# EasyEDA schematic SCH_Signal Jammer_2023-12-11.json
TITLE: Signal Jammer by A1 Electronics; REV: 1.0; Date: 2023-12-10; Sheet: 1/1; Drawn By: A Rama; Company: ahyanrblogspot.com
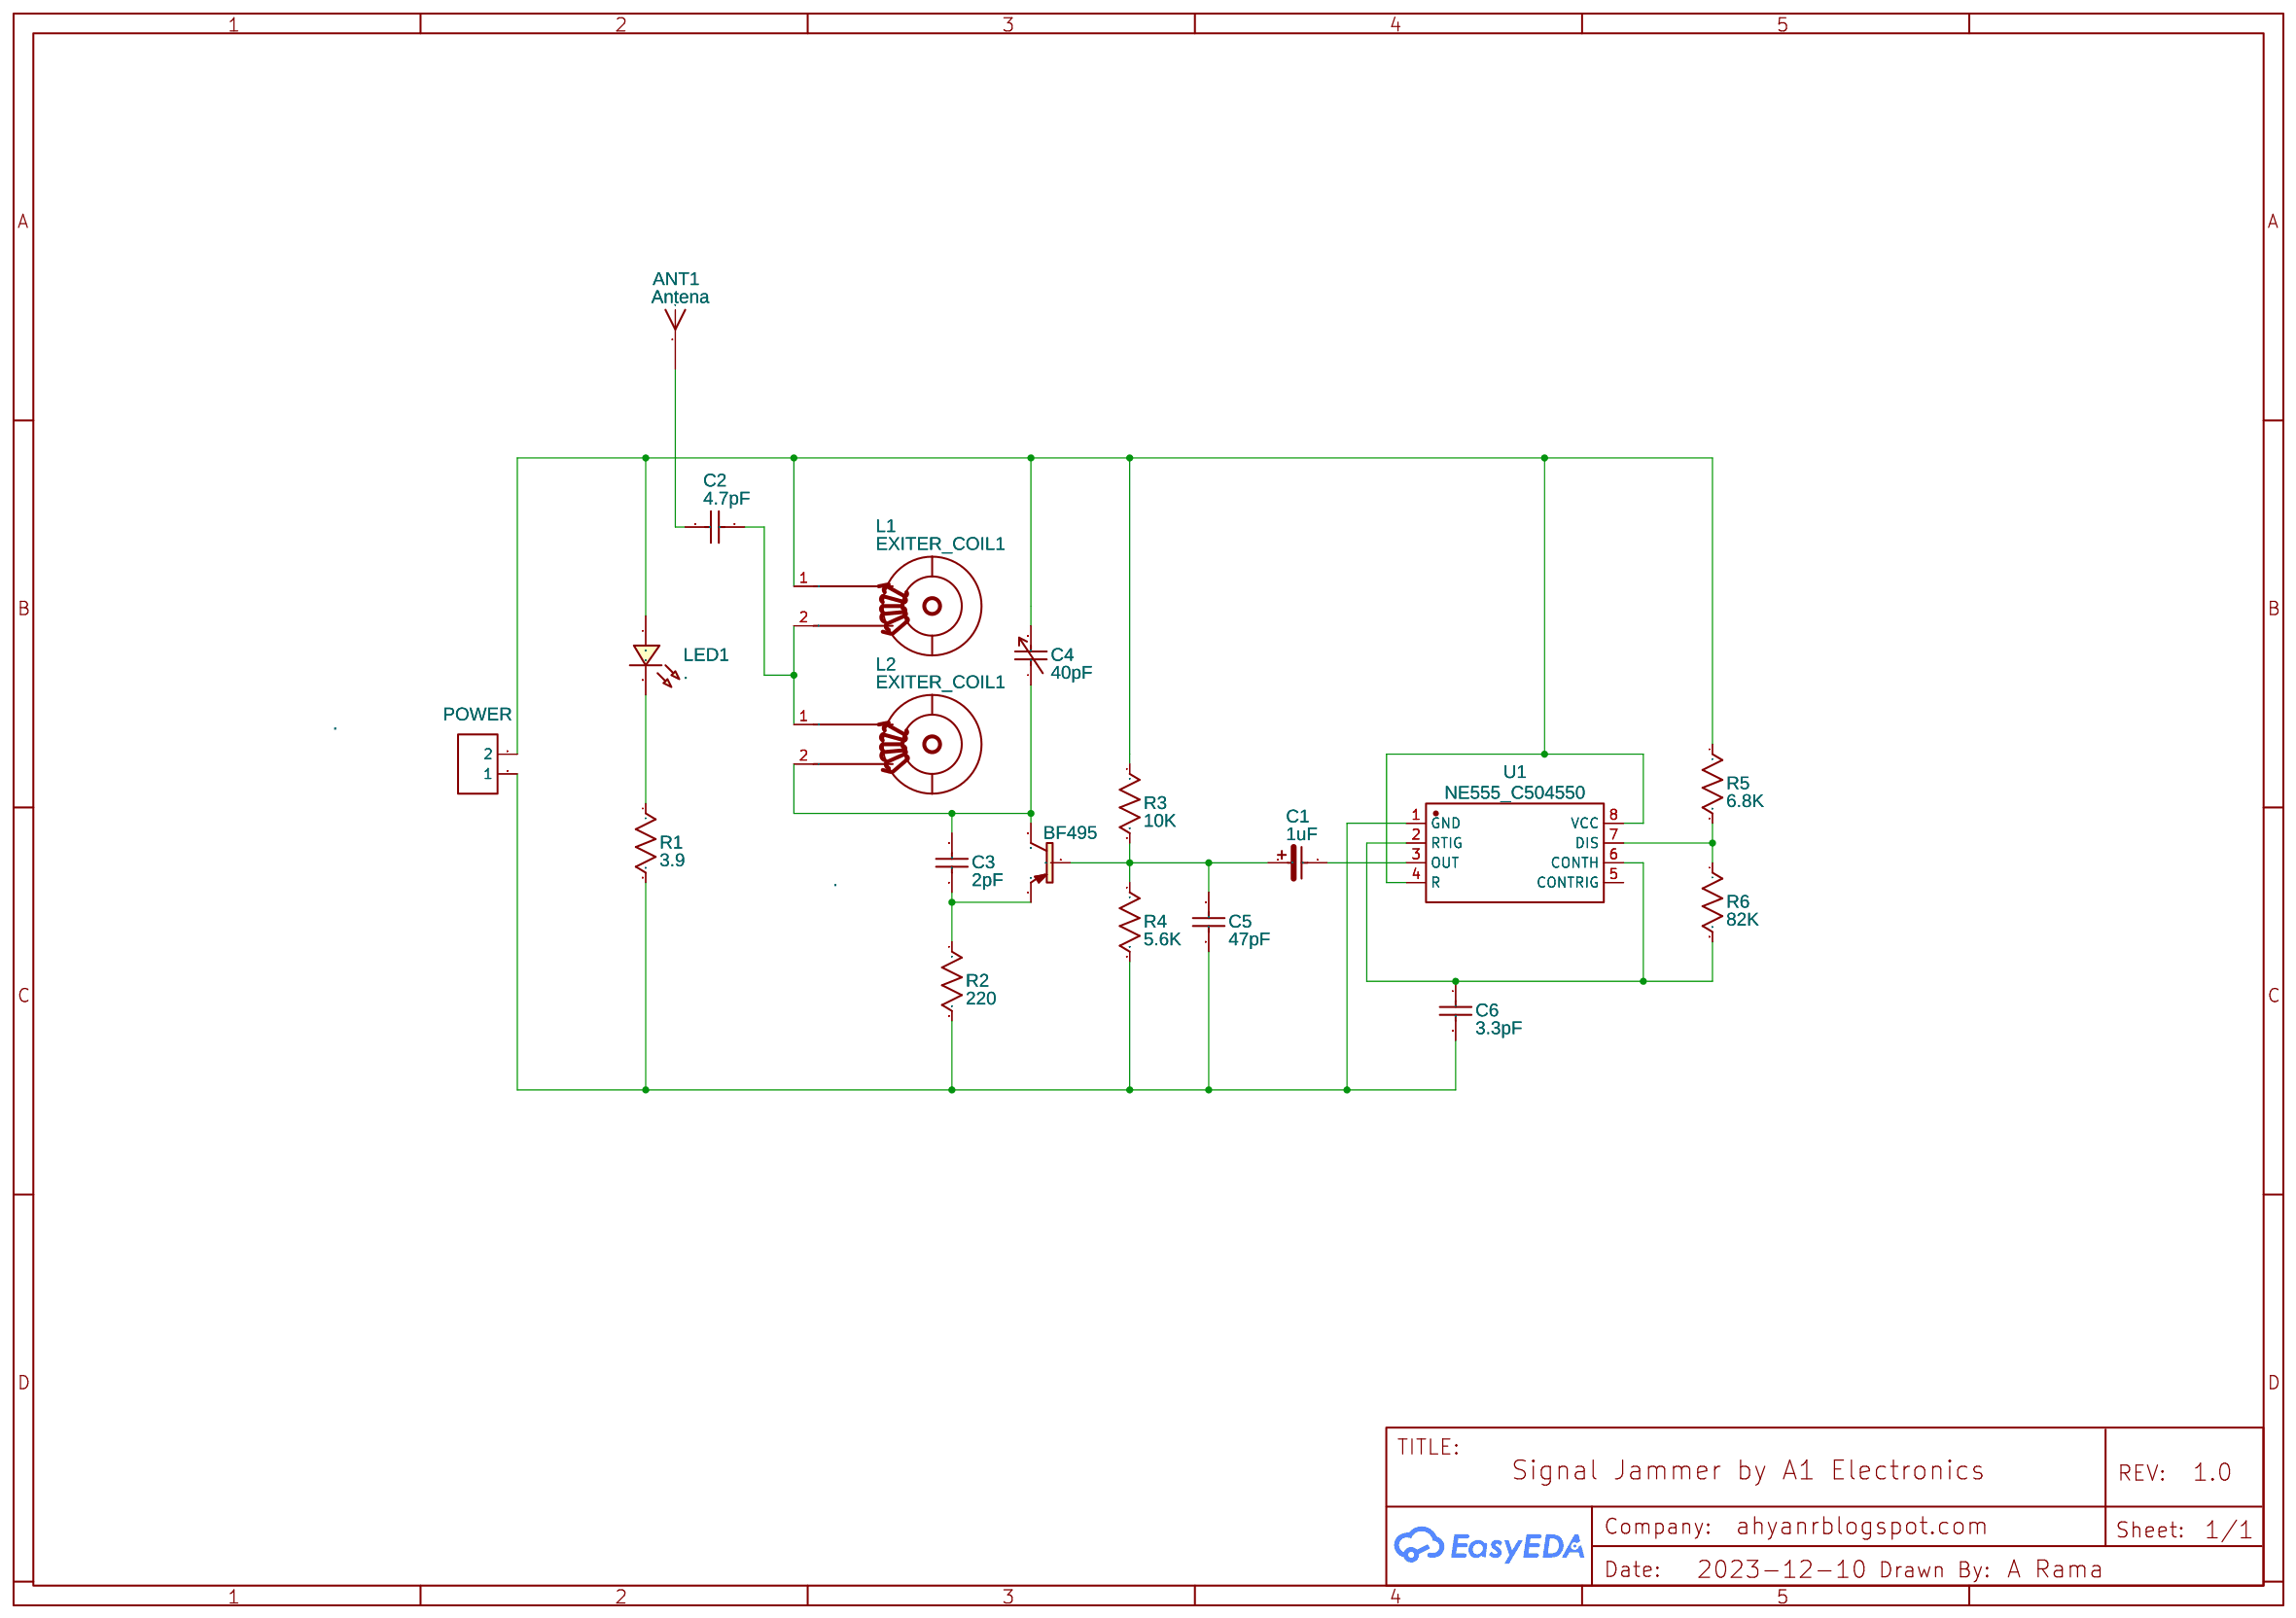
[diagram p0: schematic sheet]

## Parts
ANT1  Antena  [ANTENA_1P]
BF495  .  [TO92-CEB]
C1  1uF  [CAP-TAN-S2.5]
C2  4.7pF  [CERAMIC DISC CAPACITOR]
C3  2pF  [CERAMIC DISC CAPACITOR]
C4  40pF  [CAP-TH_JML06-1]
C5  47pF  [CERAMIC DISC CAPACITOR]
C6  3.3pF  [CERAMIC DISC CAPACITOR]
L1  EXITER_COIL1  [EXITER]
L2  EXITER_COIL1  [EXITER]
LED1  .  [LED-TH_BD5.0_RED]
POWER  .  [CONN-TH_2P-P5.00]
R1  3.9  [R_AXIAL-0.4]
R2  220  [R_AXIAL-0.4]
R3  10K  [R_AXIAL-0.4]
R4  5.6K  [R_AXIAL-0.4]
R5  6.8K  [R_AXIAL-0.4]
R6  82K  [R_AXIAL-0.4]
U1  NE555_C504550  [DIP-8_L9.7-W6.4-P2.54-LS7.6-BL]

## Library data of the parts
ANT1 = Antena: Contributor: junlakan67; Mounted: Yes
BF495 = BF495-PNP-TO92-CEB: PNP Transistror
C1 = 1uF: Supplier: LCSC; Manufacturer: AVX; Manufacturer Part: TAP105K050SCS; Supplier Part: C52309; Contributor: sennen
C2 C3 C5 C6 = Ceramic Disc Capacitor: Supplier: LCSC; Manufacturer: ReliaPro; Manufacturer Part: Calibration capacitor4.7nf 5% 100V; Contributor: LCSC; Supplier Part: C43303
C4 = JML06-1-70P: Supplier: LCSC; Manufacturer: JML; Supplier Part: C10483
L1 L2 = EXITER_COIL1 COPY: Contributor: nirajbava222
LED1 = LED-TH-5mm_R: Manufacturer: EVERLIGHT(台湾亿光); Manufacturer Part: 333-2SURD/S530-A3; Supplier Part: C87271; Supplier: LCSC; Contributor: LCEDA_Lib
POWER = CONN-TH_2P-P5.00: Supplier: LCSC; Contributor: LCEDA_Lib
R1-R6 = R_AXIAL-0.4_US: Contributor: LCEDA_Lib
U1 = NE555_C504550: Contributor: LCSC; Supplier: LCSC; Supplier Part: C504550; Manufacturer: Gcore(上海国芯); Manufacturer Part: NE555; JLCPCB Part Class: Extended Part

## Nets
Net-(ANT1-1): ANT1.1 C2.1
Net-(BF495-B): BF495.B C1.1 C5.1 R3.2 R4.1
Net-(BF495-C): BF495.C C3.1 C4.1 L2.2(E)
Net-(BF495-E): BF495.E C3.2 R2.1
Net-(C1-2): C1.2 U1.3(OUT)
Net-(C2-2): C2.2 L1.2(E) L2.1(C)
Net-(C4-2): C4.2 L1.1(C) LED1.1 POWER.2 R3.1 R5.1 U1.4(R) U1.8(VCC)
Net-(C5-2): C5.2 C6.2 POWER.1 R1.2 R2.2 R4.2 U1.1(GND)
Net-(C6-1): C6.1 R6.2 U1.2(RTIG) U1.6(CONTH)
Net-(LED1-2): LED1.2 R1.1
Net-(R5-2): R5.2 R6.1 U1.7(DIS)

Not connected (* = marked no-connect by the designer): U1 5(CONTRIG)
